# Altium project roach2_project rev2.PrjPCB (part 5 of 13)

## Sheet ppc_sys.SchDoc: PowerPC System Circuits
size A3; Date: DO NOT USE, RATHER USE PROJ OPTIONS; DrawnBy: DO NOT USE, RATHER USE PROJ OPTIONS; Engineer: DO NOT USE, RATHER USE PROJ OPTIONS; Organization: DO NOT USE, RATHER USE PROJ OPTIONS; DocumentNumber: DO NOT USE, RATHER USE PROJ OPTIONS; Revision: DO NOT USE, RATHER USE PROJ OPTIONS; SheetNumber: 5; SheetTotal: 27; SCH_Sheet_Filename: ppc_sys.SchDoc; CurrentTime: DO NOT USE, RATHER USE PROJ OPTIONS; Time: DO NOT USE, RATHER USE PROJ OPTIONS; DocumentFullPathAndName: DO NOT USE, RATHER USE PROJ OPTIONS; DocumentName: DO NOT USE, RATHER USE PROJ OPTIONS; ModifiedDate: DO NOT USE, RATHER USE PROJ OPTIONS; ImagePath: DO NOT USE, RATHER USE PROJ OPTIONS
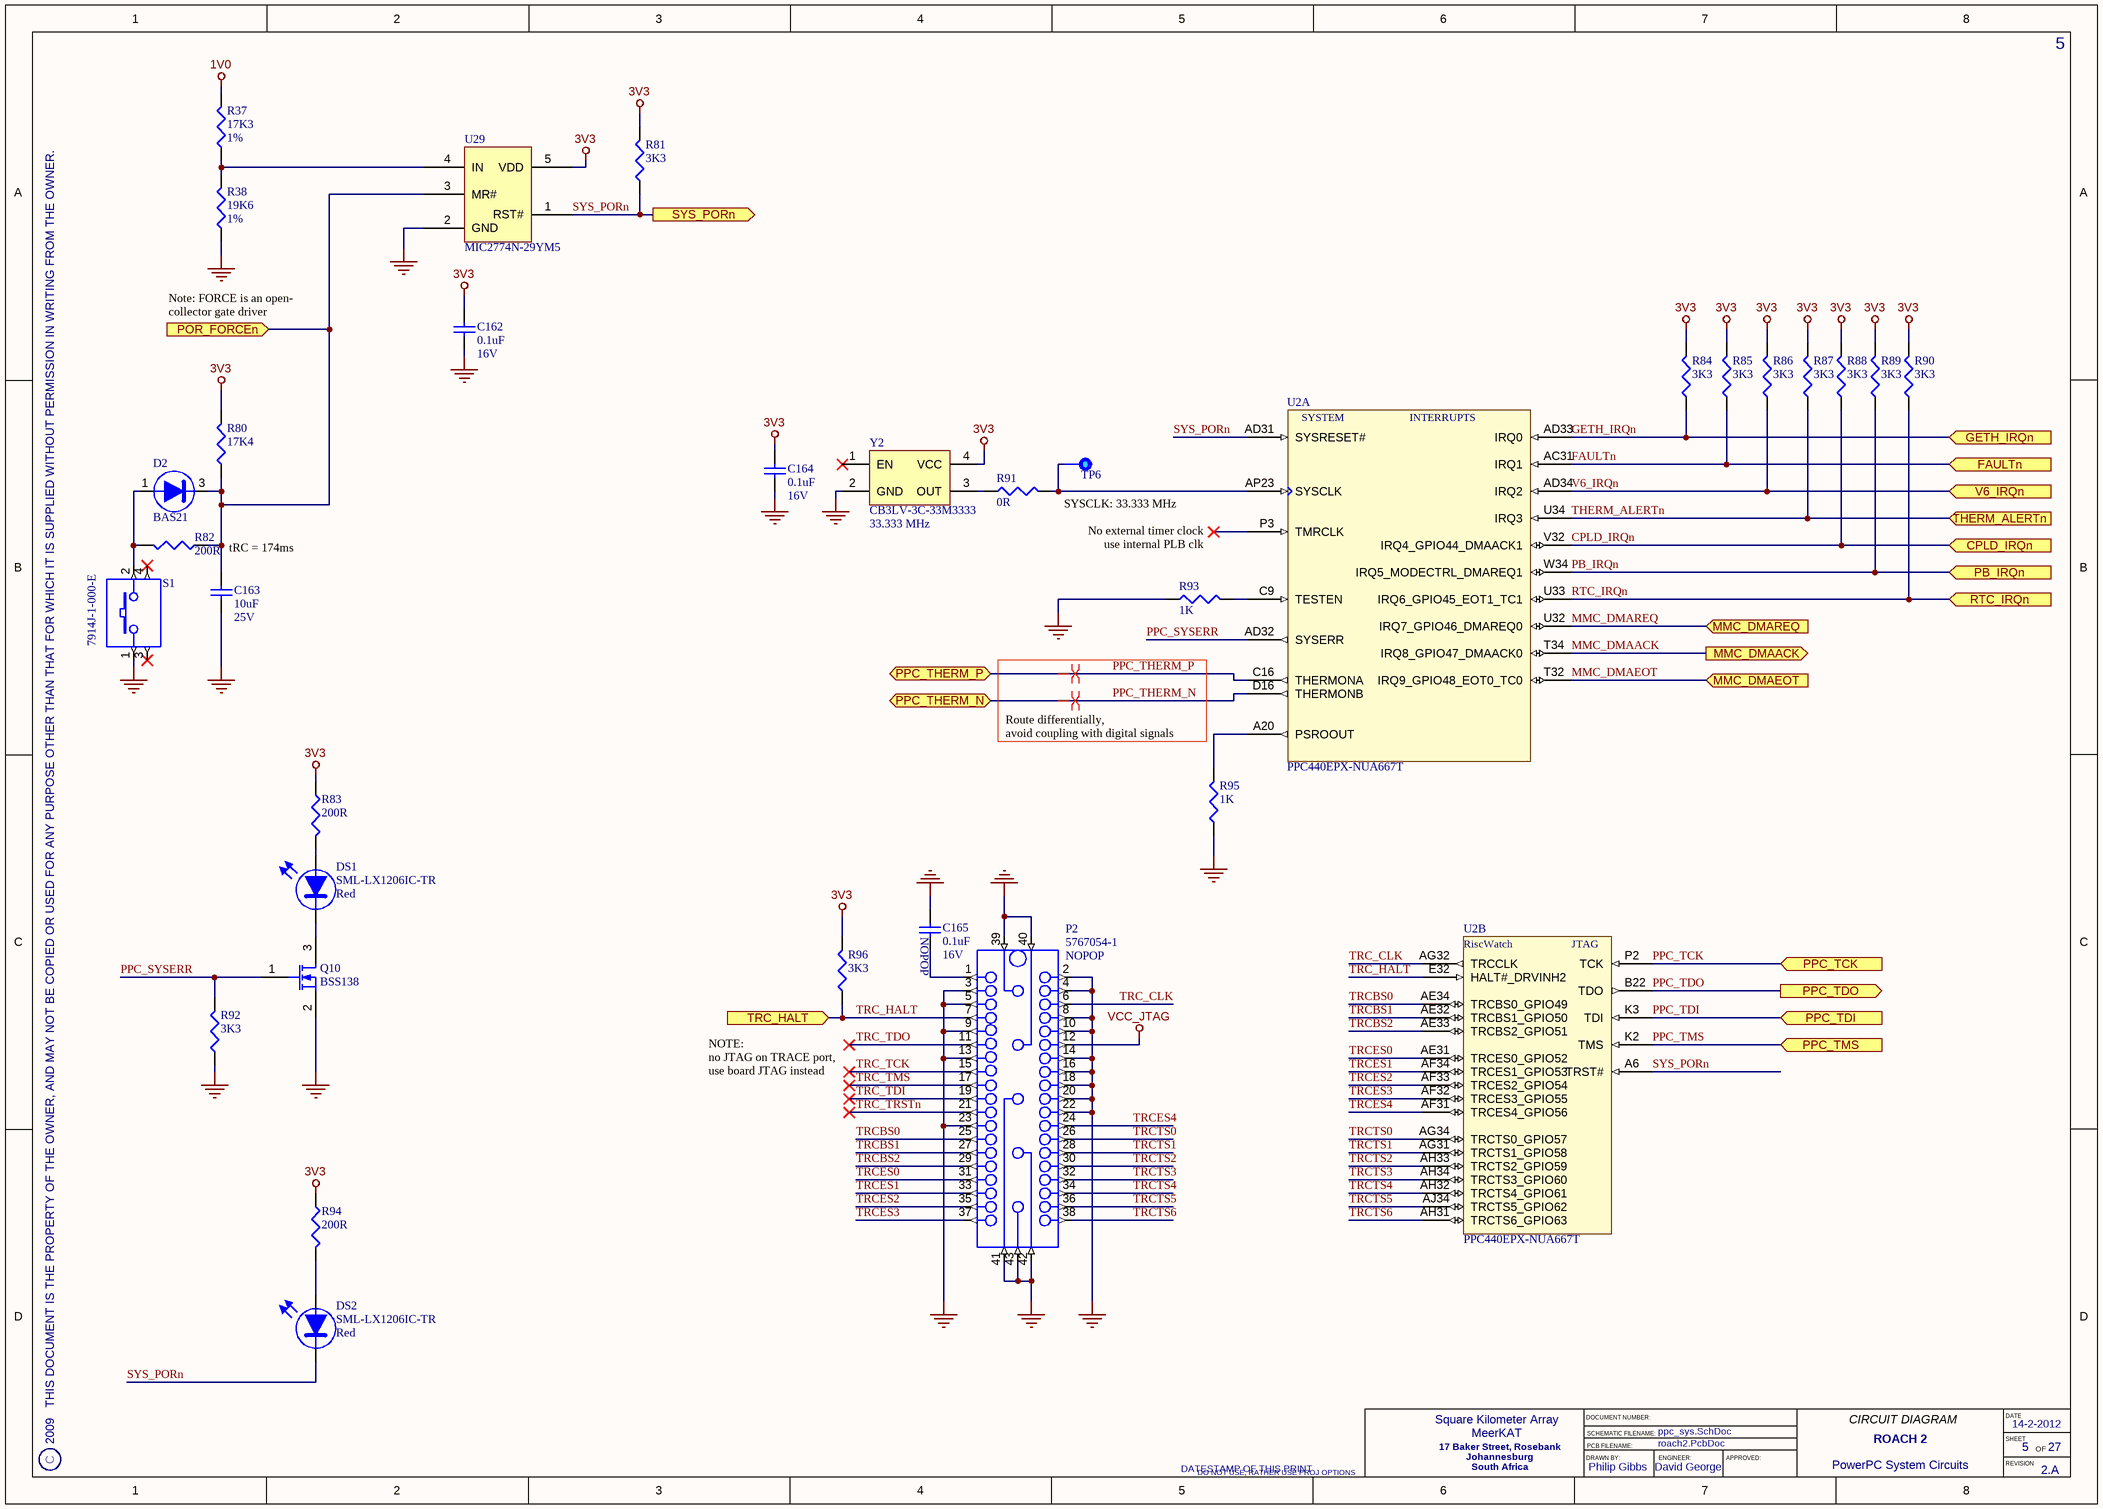
[diagram p10: ppc_sys.SchDoc]

### Parts
(Parts that share a designator on the sheet are numbered #1, #2 ... from top to bottom, then left to right.)
C162  Rating: 16V  [CAPC1005X60L]  (hidden comment: 0.1uF)
C163  Rating: 25V  [CAPC3225X200L]  (hidden comment: 10uF)
C164  Rating: 16V  [CAPC1005X60L]  (hidden comment: 0.1uF)
C165  Rating: 16V  [CAPC1005X60L]  (hidden comment: 0.1uF)
D2  BAS21  [SOT95P245X110-3N]
DS1  SML-LX1206IC-TR  Colour: Red  [LEDC3216X120N]
DS2  SML-LX1206IC-TR  Colour: Red  [LEDC3216X120N]
P2  5767054-1  [TYCO_5767054-1]
Q10  BSS138  [SOT95P245X110-3N]
R37  Tolerance: 1%  [RESC1005X40L]  (hidden comment: 17K3)
R38  Tolerance: 1%  [RESC1005X40L]  (hidden comment: 19K6)
R80  value 17K4  [RESC1005X40L]  (hidden comment: ResStd)
R81  3K3  [RESC1005X40L]
R82  200R  [RESC1005X40L]
R83  200R  [RESC1005X40L]
R84  3K3  [RESC1005X40L]
R85  3K3  [RESC1005X40L]
R86  3K3  [RESC1005X40L]
R87  3K3  [RESC1005X40L]
R88  3K3  [RESC1005X40L]
R89  3K3  [RESC1005X40L]
R90  3K3  [RESC1005X40L]
R91  0R  [RESC1005X40L]
R92  3K3  [RESC1005X40L]
R93  1K  [RESC1005X40L]
R94#2  200R  [RESC1005X40L]
R95  1K  [RESC1005X40L]
R96  3K3  [RESC1005X40L]
S1  7914J-1-000-E  [7914J-X-XXX-X]
TP6  Testpoint  [TP100]  (value not drawn)  (no BOM)
U2  PPC440EPX-NUA667T  [TE-PBGA680]  (parts A,B of 11)
U29  MIC2774N-29YM5  [SOT23-5]
Y2  Frequency: 33.333 MHz  [CB3X-X-XMX]  (hidden comment: CB3LV-3C-33M3333)

### Ports
CPLD_IRQn (in), FAULTn (in), GETH_IRQn (in), MMC_DMAACK (out), MMC_DMAEOT (in), MMC_DMAREQ (in), PB_IRQn (in), POR_FORCEn (in), PPC_TCK (in), PPC_TDI (in), PPC_TDO (out), PPC_THERM_N, PPC_THERM_P, PPC_TMS (in), RTC_IRQn (in), SYS_PORn (out), THERM_ALERTn (in), TRC_HALT (in), V6_IRQn (in)

### Nets
1V0: R37.2
3V3: C162.2 C164.2 R80.2 R81.2 R83.1 R84.2 R85.2 R86.2 R87.2 R88.2 R89.2 R90.2 R94#2.1 R96.2 U29.5(VDD) Y2.4(VCC)
GND: C162.1 C163.1 C164.1 C165.2 P2.2 P2.3 P2.4 P2.5 P2.8 P2.9 P2.10 P2.13 P2.14 P2.16 P2.18 P2.20 P2.22 P2.23 P2.39 P2.40 P2.41 P2.42 P2.43 Q10.2(S) R38.1 R92.1 R93.1 R95.1 S1.1 U29.2(GND) Y2.2(GND)
VCC_JTAG: P2.12
CPLD_IRQn: R88.1 U2.V32(IRQ4_GPIO44_DMAACK1) ; port CPLD_IRQn
FAULTn: R85.1 U2.AC31(IRQ1) ; port FAULTn
GETH_IRQn: R84.1 U2.AD33(IRQ0) ; port GETH_IRQn
MMC_DMAACK: U2.T34(IRQ8_GPIO47_DMAACK0) ; port MMC_DMAACK
MMC_DMAEOT: U2.T32(IRQ9_GPIO48_EOT0_TC0) ; port MMC_DMAEOT
MMC_DMAREQ: U2.U32(IRQ7_GPIO46_DMAREQ0) ; port MMC_DMAREQ
PB_IRQn: R89.1 U2.W34(IRQ5_MODECTRL_DMAREQ1) ; port PB_IRQn
PPC_SYSERR: Q10.1(G) R92.2 U2.AD32(SYSERR)
PPC_TCK: U2.P2(TCK) ; port PPC_TCK
PPC_TDI: U2.K3(TDI) ; port PPC_TDI
PPC_TDO: U2.B22(TDO) ; port PPC_TDO
PPC_THERM_N: U2.D16(THERMONB) ; port PPC_THERM_N
PPC_THERM_P: U2.C16(THERMONA) ; port PPC_THERM_P
PPC_TMS: U2.K2(TMS) ; port PPC_TMS
RTC_IRQn: R90.1 U2.U33(IRQ6_GPIO45_EOT1_TC1) ; port RTC_IRQn
SYS_PORn: DS2.1(K) R81.1 U2.A6(TRST#) U2.AD31(SYSRESET#) U29.1(RST#) ; port SYS_PORn
THERM_ALERTn: R87.1 U2.U34(IRQ3) ; port THERM_ALERTn
TRC_CLK: P2.6 U2.AG32(TRCCLK)
TRC_HALT: P2.7 R96.1 U2.E32(HALT#_DRVINH2) ; port TRC_HALT
TRC_TCK: P2.15
TRC_TDI: P2.19
TRC_TDO: P2.11
TRC_TMS: P2.17
TRC_TRSTn: P2.21
TRCBS0: P2.25 U2.AE34(TRCBS0_GPIO49)
TRCBS1: P2.27 U2.AE32(TRCBS1_GPIO50)
TRCBS2: P2.29 U2.AE33(TRCBS2_GPIO51)
TRCES0: P2.31 U2.AE31(TRCES0_GPIO52)
TRCES1: P2.33 U2.AF34(TRCES1_GPIO53)
TRCES2: P2.35 U2.AF33(TRCES2_GPIO54)
TRCES3: P2.37 U2.AF32(TRCES3_GPIO55)
TRCES4: P2.24 U2.AF31(TRCES4_GPIO56)
TRCTS0: P2.26 U2.AG34(TRCTS0_GPIO57)
TRCTS1: P2.28 U2.AG31(TRCTS1_GPIO58)
TRCTS2: P2.30 U2.AH33(TRCTS2_GPIO59)
TRCTS3: P2.32 U2.AH34(TRCTS3_GPIO60)
TRCTS4: P2.34 U2.AH32(TRCTS4_GPIO61)
TRCTS5: P2.36 U2.AJ34(TRCTS5_GPIO62)
TRCTS6: P2.38 U2.AH31(TRCTS6_GPIO63)
V6_IRQn: R86.1 U2.AD34(IRQ2) ; port V6_IRQn
NetC163_2: C163.2 D2.3(K) R80.1 R82.1 U29.3(MR#) ; port POR_FORCEn
NetC165_1: C165.1 P2.1
NetD2_1: D2.1(A) R82.2 S1.2
NetDS1_1: DS1.1(K) Q10.3(D)
NetDS1_2: DS1.2(A) R83.2
NetDS2_2: DS2.2(A) R94#2.2
NetR37_1: R37.1 R38.2 U29.4(IN)
NetR91_1: R91.1 Y2.3(OUT)
NetR91_2: R91.2 TP6.1 U2.AP23(SYSCLK)
NetR93_2: R93.2 U2.C9(TESTEN)
NetR95_2: R95.2 U2.A20(PSROOUT)

Not connected (* = marked no-connect by the designer): D2 2(NC); S1 3* 4*; U2 P3(TMRCLK)*; Y2 1(EN)*

### Layout directives
differential pair: PPC_THERM_N, PPC_THERM_P

### Notes on the sheet
- Note: FORCE is an open-
  collector gate driver
- SYSCLK: 33.333 MHz
- (near C163) tRC = 174ms
- No external timer clock
  use internal PLB clk
- (near R95) Route differentially,
  avoid coupling with digital signals
- (near C165) NOPOP
- (near P2) NOPOP
- (near R96) NOTE:
  no JTAG on TRACE port,
  use board JTAG instead
- 2009   THIS DOCUMENT IS THE PROPERTY OF THE OWNER, AND MAY NOT BE COPIED OR USED FOR ANY PURPOSE OTHER THAN THAT FOR WHICH IT IS SUPPLIED WITHOUT PERMISSION IN WRITING FROM THE OWNER.
- C
- DATESTAMP OF THIS PRINT
- DRAWN BY:
- DOCUMENT NUMBER:
- SCHEMATIC FILENAME:
- PCB FILENAME:
- ENGINEER:
- APPROVED:
- CIRCUIT DIAGRAM
- DATE
- SHEET
- REVISION
- OF
- (in symbol IC-CPU-1, part A) SYSTEM; INTERRUPTS
- (in symbol IC-CPU-1, part B) RiscWatch; JTAG

### Library data of the parts
C162 C164 C165 = CAP-CER-1: as C166-C168 on sheet ppc_extbus; POD number: CAP-CER-1; Value: 0.1uF; RoHS: Y; Sort Value: 0.1; Category: Capacitors; Subcategory: Ceramic
C163 = CAP-CER-5: as C274 on sheet ppc_net; POD number: CAP-CER-5; Value: 10uF; RoHS: Y; Sort Value: 100; Category: Capacitors; Subcategory: Ceramic
D2 = DIODE-STD-0: General Purpose, High Voltage, Diode; Manufacturer: Fairchild Semi; VForward: 1V; POD number: DIODE-STD-0; PartNum: BAS21; RoHS: Y; Category: Diode; Subcategory: STD
DS1 DS2 = OPTO-LED-1: as DS28 on sheet ppc_serial; POD number: OPTO-LED-1; PartNum: SML-LX1206IC-TR; RoHS: Y; Category: OPTO; Subcategory: LED
P2 = CONN-PCB-9: TRACE Debug Interface Receptacle; Manufacturer: TYCO; POD number: CONN-PCB-9; PartNum: 5767054-1; RoHS: Y; Category: CONN; Subcategory: PCB
Q10 = TRANS-NFET-0: as Q11 on sheet ppc_serial; POD number: TRANS-NFET-0; PartNum: BSS138; RoHS: Y; Category: TRANS; Subcategory: NFET
R37 = RES-TF-31: 17K3, 1.1mm x 0.5mm, Thick Film Resistor; Manufacturer: ROYALOHM; PartNum: 0402WGF1732T1E; Rating: 0.0625W; POD number: RES-TF-31; Value: 17K3; Sort Value: 17300; Category: Resistors; Subcategory: ThickFilm; HelpURL: *.pdf
R38 = RES-TF-29: 19K6, 1.1mm x 0.5mm, Thick Film Resistor; Manufacturer: ROYALOHM; PartNum: 0402WGF1962T1E; Rating: 0.0625W; POD number: RES-TF-29; Value: 19K6; Sort Value: 19600; Category: Resistors; Subcategory: ThickFilm; HelpURL: *.pdf
R80 = RES-TF-30: 17K4, 1.1mm x 0.5mm, Thick Film Resistor; POD number: RES-TF-30
R81 R84-R90 R92 R96 = RES-TF-7: as R97-R104 on sheet ppc_extbus; POD number: RES-TF-7; Value: 3K3; Sort Value: 3300; Category: Resistors; Subcategory: ThickFilm; HelpURL: *.pdf
R82 R83 R94#2 = RES-TF-19: as R123 on sheet ppc_extbus; POD number: RES-TF-19; Value: 200R; Sort Value: 200; Category: Resistors; Subcategory: ThickFilm; HelpURL: *.pdf
R91 = RES-TF-0: as R105 on sheet ppc_extbus; POD number: RES-TF-0; Value: 0R; Sort Value: 0; Category: Resistors; Subcategory: ThickFilm; HelpURL: *.pdf
R93 R95 = RES-TF-8: as R111 on sheet ppc_extbus; POD number: RES-TF-8; Value: 1K; Sort Value: 1000; Category: Resistors; Subcategory: ThickFilm; HelpURL: *.pdf
S1 = ELMECH-SW-1: 4mm, Surface mount, Sealed Key Switch; Manufacturer: BOURNS; POD number: ELMECH-SW-1; PartNum: 7914J-1-000-E; RoHS: Y; Category: ELMECH; Subcategory: Switches
TP6 = ELMECH-TP-0: as TP28 on sheet ppc_extbus; POD number: ELMECH-TP-0; RoHS: Y; Category: ELMECH; Subcategory: Test Points
U2 = IC-CPU-1: as U2 on sheet ppc_extbus; POD number: IC-CPU-1; PartNum: PPC440EPX-NUA667T; RoHS: Y; Category: IC; Subcategory: CPU
U29 = IC-MON-4: Dual-power low voltage supervisor; Manufacturer: Micrel; POD number: IC-MON-4; PartNum: MIC2774N-29YM5; RoHS: Y; Category: IC; Subcategory: Monitoring
Y2 = RESN-CLK-1: Surface mount, 33.3333 MHz, 3V3 Clock, oscillator; Manufacturer: CTS; POD number: RESN-CLK-1; PartNum: CB3LV-3C-33M3333; RoHS: Y; Category: RESN; Subcategory: Clock Oscillators